# EAGLE design SparkFun_Qwiic_PIR (EAGLE 9.6.0)
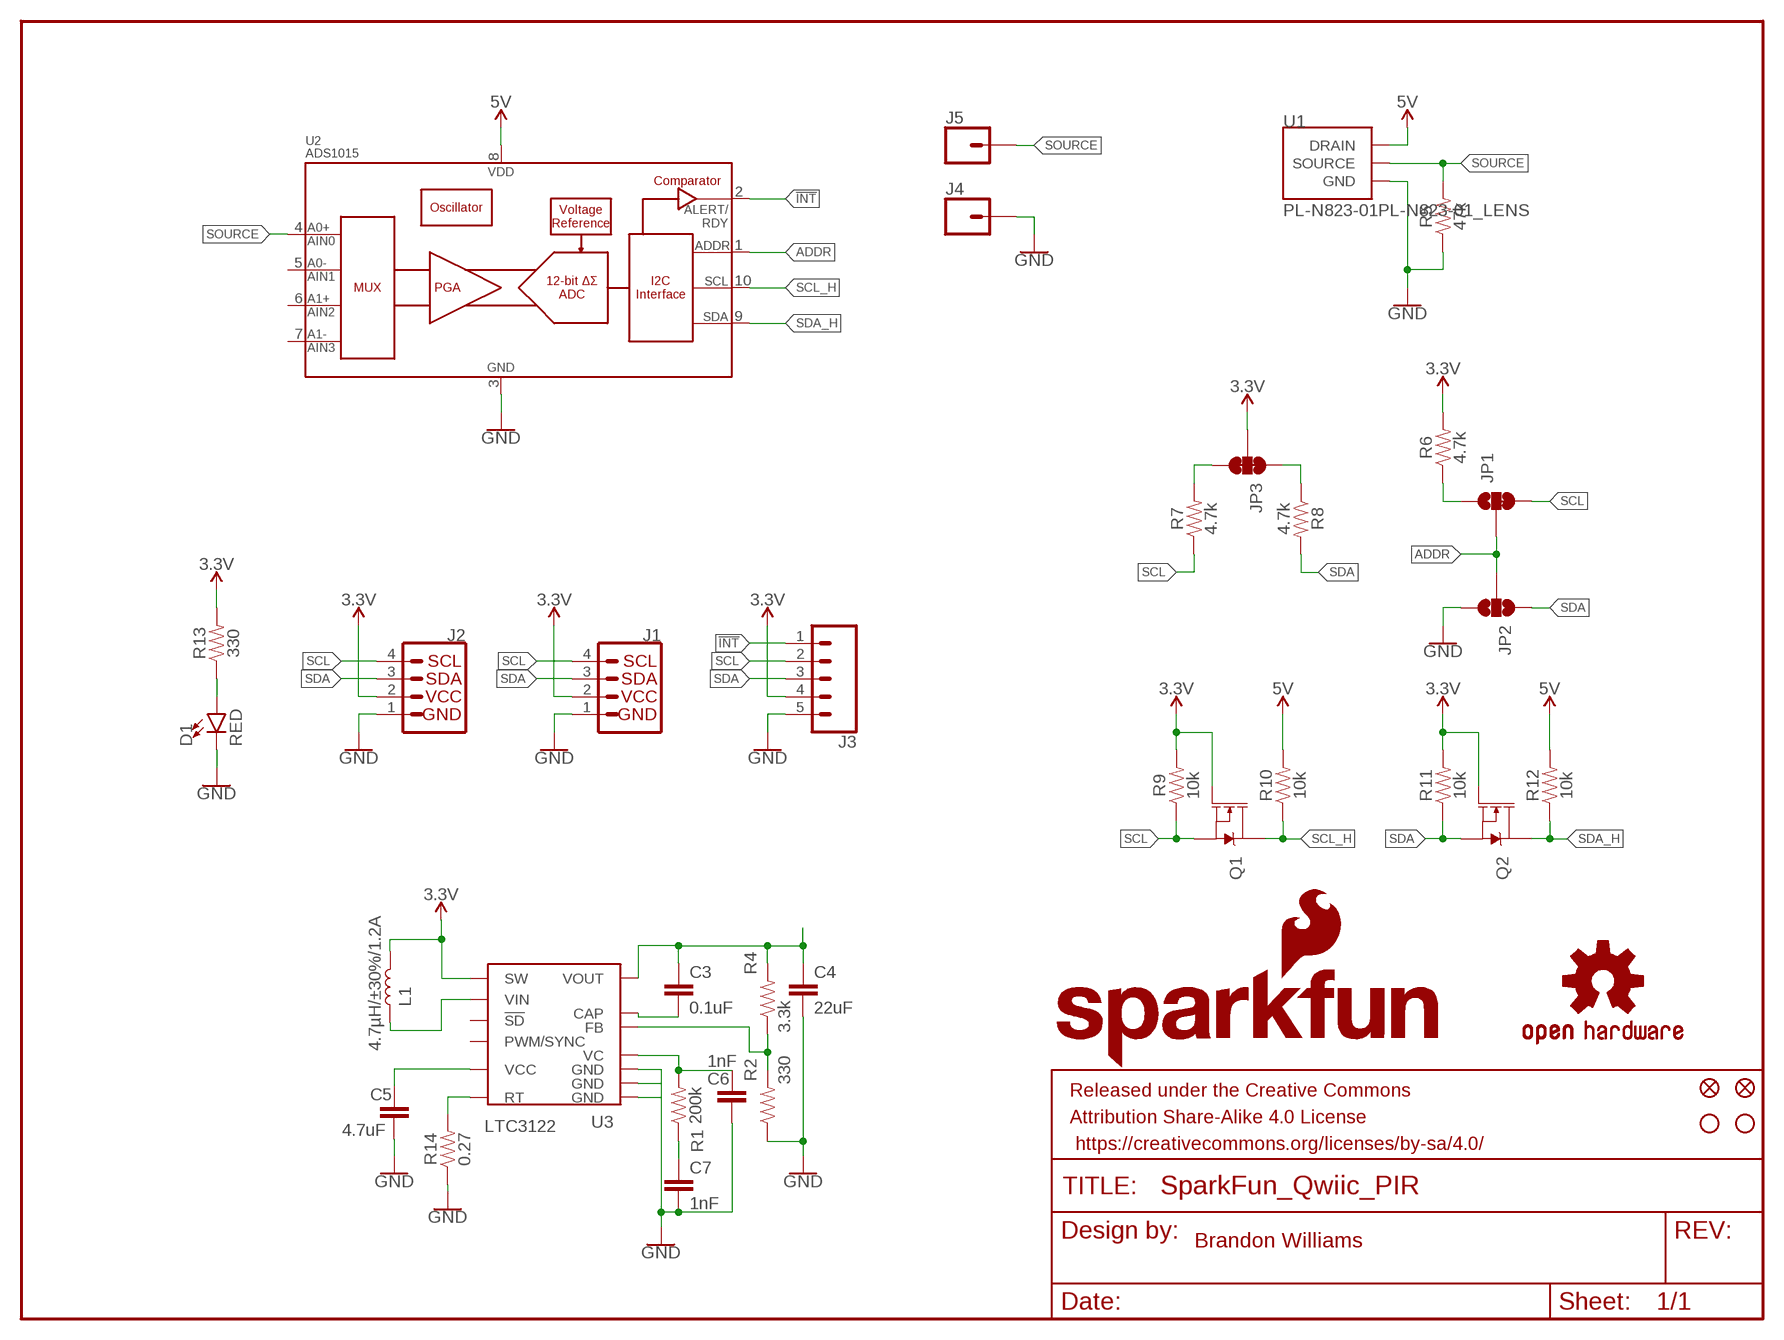
[diagram p0: schematic, sheet 1]

## Parts
C3  0.1uF  0.1UF-0603-25V-(+80/-20%)  [0603]
C4  22uF  22UF-0805-6.3V-20%  [0805]
C5  4.7uF  4.7UF-1206-16V-(+80/-20%)  [1206]
C6  1nF  1.0NF/1000PF-0603-50V-10%  [0603]
C7  1nF  1.0NF/1000PF-0603-50V-10%  [0603]
D1  RED  LED-RED0603  [LED-0603]
FD1  FIDUCIAL0.2MM  [FIDUCIAL-0.2MM]
FD2  FIDUCIAL0.2MM  [FIDUCIAL-0.2MM]
FRAME1  FRAME-LETTERNO_PACKAGE  [DUMMY]
H1  STAND-OFFTIGHT  [STAND-OFF-TIGHT]
H2  STAND-OFFTIGHT  [STAND-OFF-TIGHT]
J1  QWIIC_RIGHT_ANGLE  QWIIC_CONNECTORJS-1MM  [JST04_1MM_RA]
J2  QWIIC_RIGHT_ANGLE  QWIIC_CONNECTORJS-1MM  [JST04_1MM_RA]
J3  CONN_05NO_SILK  [1X05_NO_SILK]
J4  CONN_01PTH_NO_SILK_YES_STOP  [1X01_NO_SILK]
J5  CONN_01PTH_NO_SILK_YES_STOP  [1X01_NO_SILK]
JP1  JUMPER-SMT_3_1-NC_TRACE_SILK  [SMT-JUMPER_3_1-NC_TRACE_SILK]
JP2  JUMPER-SMT_3_NO_SILK  [SMT-JUMPER_3_NO_SILK]
JP3  JUMPER-SMT_3_2-NC_TRACE_SILK  [SMT-JUMPER_3_2-NC_TRACE_SILK]
L1  4.7µH/±30%/1.2A  INDUCTOR-CDRH-4.7UH  [INDUCTOR_4.7UH]
LOGO1  OSHW-LOGOMINI  [OSHW-LOGO-MINI]
LOGO3  SFE_LOGO_NAME_FLAME.2_INCH  [SFE_LOGO_NAME_FLAME_.2]
Q1  220mA/50V/3.5Ω  MOSFET-NCH-BSS138  [SOT23-3]
Q2  220mA/50V/3.5Ω  MOSFET-NCH-BSS138  [SOT23-3]
R1  200k  200KOHM-0603-1/10W-1%  [0603]
R2  330  330OHM-0603-1/10W-1%  [0603]
R4  3.3k  3.3KOHM-0603-1/10W-1%  [0603]
R5  47k  47KOHM-0603-1/10W-1%  [0603]
R6  4.7k  4.7KOHM-0603-1/10W-1%  [0603]
R7  4.7k  4.7KOHM-0603-1/10W-1%  [0603]
R8  4.7k  4.7KOHM-0603-1/10W-1%  [0603]
R9  10k  10KOHM-0402T-1/16W-1%  [0402-TIGHT]
R10  10k  10KOHM-0402T-1/16W-1%  [0402-TIGHT]
R11  10k  10KOHM-0402T-1/16W-1%  [0402-TIGHT]
R12  10k  10KOHM-0402T-1/16W-1%  [0402-TIGHT]
R13  330  330OHM-0603-1/10W-1%  [0603]
R14  0.27  0.27OHM-0603-1/10W-1%  [0603]
U1  PL-N823-01PL-N823-01_LENS  [PL-N823-01_LENS]
U2  ADS1015  [MSOP10]
U3  LTC3122  [LTC3122EDE#PBF]

## Nets
3.3V: J1.2 J2.2 J3.4 JP3.2 L1.P$2 Q1.1(G) Q2.1(G) R6.2 R9.2 R11.2 R13.2 U3.P$1(SW)
5V: R10.2 R12.2 U1.DRAIN U2.8(VDD)
!INT: J3.1 U2.2(ALERT/RDY)
ADDR: JP1.2 JP2.2 U2.1(ADDR)
GND: C4.2 C5.2 C6.2 C7.2 D1.C J1.1 J2.1 J3.5 J4.1 JP2.3 R2.1 R5.1 R14.1 U1.GND@1(GND) U1.GND@2(GND) U2.3(VSS) U3.P$2(GND) U3.P$10(GND) U3.P$13(GND)
N$1: C5.1 U3.P$5(VCC)
N$2: JP1.1 R6.1
N$3: L1.P$1 U3.P$3(VIN)
N$4: D1.A R13.1
N$5: R14.2 U3.P$6(RT)
N$6: C3.1 C4.1 R4.2 U3.P$11(VOUT)
N$7: C3.2 U3.P$12(CAP)
N$8: JP3.1 R8.1
N$9: JP3.3 R7.2
N$10: R2.2 R4.1 U3.P$8(FB)
N$11: C6.1 R1.2 U3.P$7(VC)
N$12: C7.1 R1.1
SCL: J1.4 J2.4 J3.2 JP1.3 Q1.2(S) R7.1 R9.1
SCL_H: Q1.3(D) R10.1 U2.10(SCL)
SDA: J1.3 J2.3 J3.3 JP2.1 Q2.2(S) R8.2 R11.1
SDA_H: Q2.3(D) R12.1 U2.9(SDA)
SOURCE: J5.1 R5.2 U1.SOURCE U2.4(AIN0)
Unconnected: U2.5(AIN1) U2.6(AIN2) U2.7(AIN3) U3.P$4(PWM/SYNC) U3.P$9(!SD)

## Notes on the sheet
- Brandon Williams

## Library data of the parts
C3 = SparkFun-Capacitors:0.1UF: 0.1µF ceramic capacitors A capacitor is a passive two-terminal electrical component used to store electrical energy temporarily in an electric field.; PROD_ID: CAP-00810
C4 = SparkFun-Capacitors:22UF: 22µF ceramic capacitors A capacitor is a passive two-terminal electrical component used to store electrical energy temporarily in an electric field.; PROD_ID: CAP-08402
C5 = SparkFun-Capacitors:4.7UF: 4.7µF ceramic capacitors A capacitor is a passive two-terminal electrical component used to store electrical energy temporarily in an electric field.; PROD_ID: CAP-10300
C6 C7 = SparkFun-Capacitors:1.0NF/1000PF: 1nF/1,000pF ceramic capacitors A capacitor is a passive two-terminal electrical component used to store electrical energy temporarily in an electric field.; PROD_ID: CAP-07886
D1 = SparkFun-LED:LED-RED: Red SMD LED Used in manufacturing of most products at SparkFun Packages: 0603 - SMD 0603 package [Product Link] <http://docs.avagotech.com/docs/AV02-0551EN> 0603 SMART - SMD 0603 SMART package ( more efficient and expensive)[Product Link] <http://www.osram-os.com/Graphics/XPic2/00077099_0.pdf> 1206 - SMD1206 package [Product Link] <https://www.sparkfun.com/datasheets/DevTools/LilyPad/Q150OVS4.pdff> SparkFun Products: Pro Mini 328 -5V <https://www.sparkfun.com/products/821> RedBoard <https://www.sparkfun.com/products/12757> IOIO-OTG <https://www.sparkfun.com/products/13613>; PROD_ID: DIO-00819
FD1 FD2 = SparkFun-Aesthetics:FIDUCIAL: Fiducial Alignment Points Point-of-reference for pick-and-place machines and other optical instruments.
FRAME1 = SparkFun-Aesthetics:FRAME-LETTER: Schematic Frame - Letter Standard 8.5x11 US Letter frame; DESIGNER: Nobody; VERSION: v01
H1 H2 = SparkFun-Hardware:STAND-OFF: Stand Off Drill holes for mechanically mounting via screws, standoffs, etc. Note: Use the keepout ring to avoid running the screw head into surrounding components. Variant Overviews STAND-OFF - Mechanical footprint for a #4 phillips button head screw. STAND-OFF-TIGHT - Mechanical footprint for a #4 phillips button head screw, Example SparkFun Products Screw - Phillips Head (1/4", 4-40, 10 pack) <https://www.sparkfun.com/products/10453> (PRT-10453) Screw - Phillips Head (1/2", 4-40, 10 pack) <https://www.sparkfun.com/products/10452> (PRT-10452) Screw - Phillips Head (3/4", 4-40, 10 pack) <https://www.sparkfun.com/products/10451> (PRT-10451) Screw - Phillips Head (1", 4-40, 10 pack) <https://www.sparkfun.com/products/10450> (PRT-10450)
J1 J2 = SparkFun-Connectors:QWIIC_CONNECTOR: SparkFun I2C Standard Qwiic Connector An SMD 1mm pitch JST connector makes it easy and quick (get it? Qwiic?) to connect I2C devices to each other. The Qwiic system <http://www.sparkfun.com/qwiic> enables fast and solderless connection between popular platforms and various sensors and actuators. We carry 200mm <https://www.sparkfun.com/products/14204>, 100mm <https://www.sparkfun.com/products/14205>, 50mm <https://www.sparkfun.com/products/14206>, and breadboard friendly <https://www.sparkfun.com/products/14207> Qwiic cables. We also offer 10 pcs strips <https://www.sparkfun.com/products/14323> the SMD connectors.; PROD_ID: CONN-13694
J3 = SparkFun-Connectors:CONN_05: Multi connection point. Often used as Generic Header-pin footprint for 0.1 inch spaced/style header connections On any of the 0.1 inch spaced packages, you can populate with these: Break Away Headers - Straight <https://www.sparkfun.com/products/116> (PRT-00116) Break Away Male Headers - Right Angle <https://www.sparkfun.com/products/553> (PRT-00553) Female Headers <https://www.sparkfun.com/products/115> (PRT-00115) Break Away Headers - Machine Pin <https://www.sparkfun.com/products/117> (PRT-00117) Break Away Female Headers - Swiss Machine Pin <https://www.sparkfun.com/products/743> (PRT-00743) For SCREWTERMINALS and SPRING TERMINALS visit here: Screw Terimnals on SparkFun.com <https://www.sparkfun.com/search/results?term=Screw+Terminals> (5mm/3.5mm/2.54mm spacing) This device is also useful as a general connection point to wire up your design to another part of your project. Our various solder wires solder well into these plated through hole pads. Hook-Up Wire - Assortment (Stranded, 22 AWG) <https://www.sparkfun.com/products/11375> (PRT-11375) Hook-Up Wire - Assortment (Solid Core, 22 AWG) <https://www.sparkfun.com/products/11367> (PRT-11367) View the entire wire category on our website here <https://www.sparkfun.com/categories/141> Special notes: Molex polarized connector foot print use with SKU : PRT-08231 with associated crimp pins and housings. 1MM SMD Version SKU: PRT-10208
J4 J5 = SparkFun-Connectors:CONN_01: Single connection point. Often used as Generic Header-pin footprint for 0.1 inch spaced/style header connections On any of the 0.1 inch spaced packages, you can populate with these: Break Away Headers - Straight <https://www.sparkfun.com/products/116> (PRT-00116) Break Away Male Headers - Right Angle <https://www.sparkfun.com/products/553> (PRT-00553) Female Headers <https://www.sparkfun.com/products/115> (PRT-00115) Break Away Headers - Machine Pin <https://www.sparkfun.com/products/117> (PRT-00117) Break Away Female Headers - Swiss Machine Pin <https://www.sparkfun.com/products/743> (PRT-00743) This device is also useful as a general connection point to wire up your design to another part of your project. Our various solder wires solder well into these plated through hole pads. Hook-Up Wire - Assortment (Stranded, 22 AWG) <https://www.sparkfun.com/products/11375> (PRT-11375) Hook-Up Wire - Assortment (Solid Core, 22 AWG) <https://www.sparkfun.com/products/11367> (PRT-11367) View the entire wire category on our website here <https://www.sparkfun.com/categories/141> Special notes: SMTSO-256-ET is a "flush mount" nut for a 4-40 screw. We mostly use this on specialty testbeds; it is a nice way to connect hardware to your PCB at an adjustable hieght. Also note, the SNAP packages are for using a snappable style connector. We sell a baggie of snaps and they are also used on two LilyPad designs: Snap Assortment - 30 pack (male and female) <https://www.sparkfun.com/products/11347> (DEV-11347) LilyPad Arduino SimpleSnap <https://www.sparkfun.com/products/10941> (DEV-10941) LilyPad SimpleSnap Protoboard <https://www.sparkfun.com/products/10940> (DEV-10940)
JP1 = SparkFun-Jumpers:JUMPER-SMT_3_1-NC_TRACE: Normally closed trace jumper (1 of 2 connections) This jumper has a trace between two pads so it's normally closed (NC). The other connection is normally open (NO). Use a razor knife to open the connection. For best results follow the IPC guidelines for cutting traces: Cutout at least 0.063 mm (0.005 in). Remove all loose material to clean up the cut area. Seal the cut with an approved epoxy. Reapply solder to reclose the connection, or to close the NO connection.
JP2 = SparkFun-Jumpers:JUMPER-SMT_3_NO: Normally open jumper This jumper has three pads in close proximity to each other. Apply solder to close the connection(s).
JP3 = SparkFun-Jumpers:JUMPER-SMT_3_2-NC_TRACE: Normally closed trace jumper (2 of 2 connections) This jumper has a trace between all three pads so they are normally closed (NC). Use a razor knife to open the connection(s). For best results follow the IPC guidelines for cutting traces: Cutout at least 0.063 mm (0.005 in). Remove all loose material to clean up the cut area. Seal the cut with an approved epoxy. Reapply solder to reclose the connection(s).
L1 = SparkFun-Coils:INDUCTOR: Inductors Resist changes in electrical current. Basically a coil of wire. SparkFun Products: SparkFun Load Cell Amplifier - HX711 <https://www.sparkfun.com/products/13879> IOIO-OTG - V2.2 <https://www.sparkfun.com/products/13613>; PROD_ID: NDUC-10146
LOGO1 = SparkFun-Aesthetics:OSHW-LOGO: Open-Source Hardware (OSHW) Logo This logo indicates the piece of hardware it is found on incorporates a OSHW license and/or adheres to the definition of open source hardware found here: http://freedomdefined.org/OSHW
LOGO3 = SparkFun-Aesthetics:SFE_LOGO_NAME_FLAME: SparkFun Font Logo w/ Flame This is the SparkFun full logo. The logo on the schematic will always be the same size; the package variant is the height of the flame part of the logo. Default layer for the logo on the board is tSilk.
Q1 Q2 = SparkFun-DiscreteSemi:MOSFET-NCH: N-channel MOSFETs Voltage controlled devices that allow control of high current outputs. SparkFun Products: SparkFun OpenScale <https://www.sparkfun.com/products/13261> SparkFun Digital Sandbox <https://www.sparkfun.com/products/12651> SparkFun Monster Moto Shield <https://www.sparkfun.com/products/10182> SparkFun MOSFET Power Controller <https://www.sparkfun.com/products/11214>; PROD_ID: TRANS-00830
R1 = SparkFun-Resistors:200KOHM: 200kΩ resistor A resistor is a passive two-terminal electrical component that implements electrical resistance as a circuit element. Resistors act to reduce current flow, and, at the same time, act to lower voltage levels within circuits. - Wikipedia; PROD_ID: RES-09385
R2 R13 = SparkFun-Resistors:330OHM: 330Ω resistor A resistor is a passive two-terminal electrical component that implements electrical resistance as a circuit element. Resistors act to reduce current flow, and, at the same time, act to lower voltage levels within circuits. - Wikipedia; PROD_ID: RES-00818
R4 = SparkFun-Resistors:3.3KOHM: 3.3kΩ resistor A resistor is a passive two-terminal electrical component that implements electrical resistance as a circuit element. Resistors act to reduce current flow, and, at the same time, act to lower voltage levels within circuits. - Wikipedia; PROD_ID: RES-07851
R5 = SparkFun-Resistors:47KOHM: 47kΩ resistor A resistor is a passive two-terminal electrical component that implements electrical resistance as a circuit element. Resistors act to reduce current flow, and, at the same time, act to lower voltage levels within circuits. - Wikipedia; PROD_ID: RES-07871
R6-R8 = SparkFun-Resistors:4.7KOHM: 4.7kΩ resistor A resistor is a passive two-terminal electrical component that implements electrical resistance as a circuit element. Resistors act to reduce current flow, and, at the same time, act to lower voltage levels within circuits. - Wikipedia; PROD_ID: RES-07857
R9-R12 = SparkFun-Resistors:10KOHM: 10kΩ resistor A resistor is a passive two-terminal electrical component that implements electrical resistance as a circuit element. Resistors act to reduce current flow, and, at the same time, act to lower voltage levels within circuits. - Wikipedia; PROD_ID: RES-14241
R14 = SparkFun-Resistors:0.27OHM: 0.27Ω resistor A resistor is a passive two-terminal electrical component that implements electrical resistance as a circuit element. Resistors act to reduce current flow, and, at the same time, act to lower voltage levels within circuits. - Wikipedia; PROD_ID: RES-08787
U1 = PL-N823-01:PL-N823-01: Lensless passive infrared sensor from Kemet Electronics
U2 = SparkFun-IC-Conversion:ADS1015: ADS1015 12-BIT ADC 12-Bit Del-Sig ADC Four single-ended inputs or two differential inputs Internal PGA I2C interface 2.0-5.5V SparkFun Products SparkFun Block for Intel Edison - ADC <https://www.sparkfun.com/products/13770> (DEV-13770); PROD_ID: IC-12270
U3 = LTC3122:LTC3122; PROD_ID: LTC3122

## Board
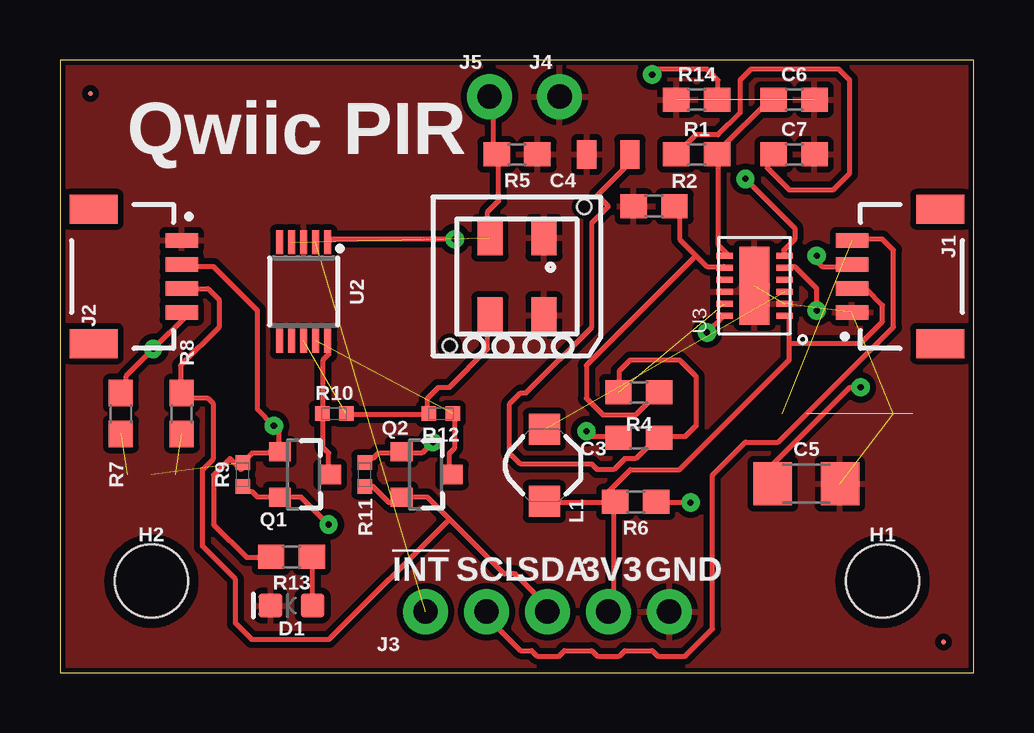
[diagram p1: board, top side]
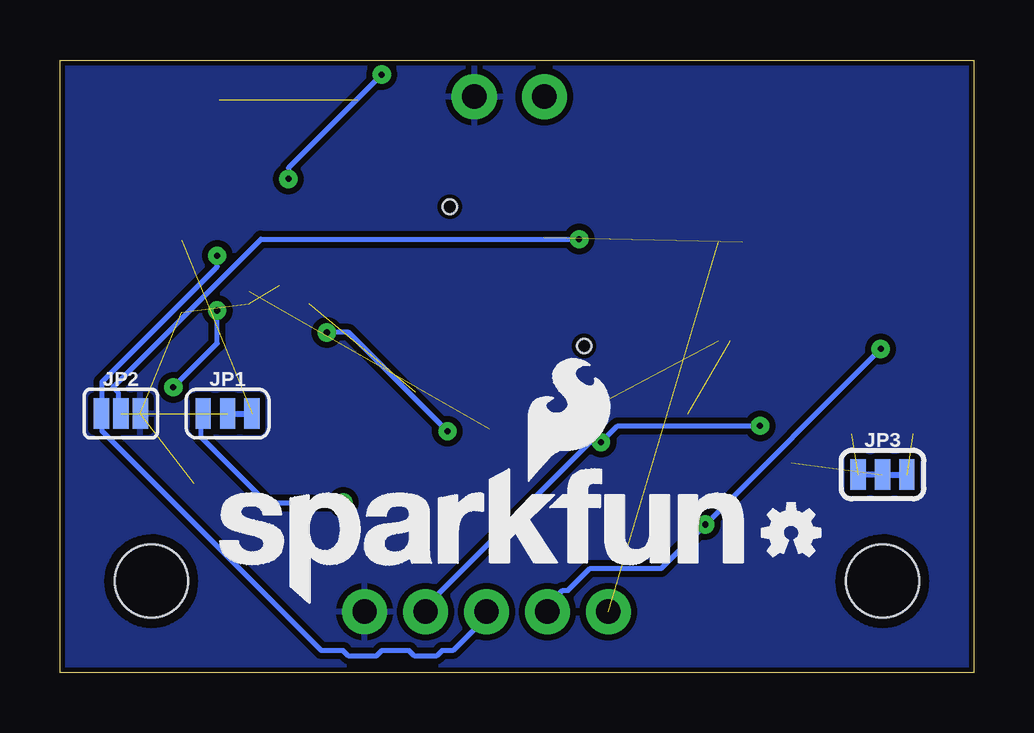
[diagram p2: board, bottom side, seen from below]

Size 38.1 x 25.53 mm. Coordinates in mm from the lower left corner, seen from the top.
Outline: 0,0 38.1,0 38.1,25.53 0,25.53 0,0
Copper layers (1*16): Top 0.035mm / dielectric 1.5mm / Bottom 0.035mm
Design rules "SparkFun-2-layer-STANDARD *": minimum track width 8mil, minimum drill 10mil, track to track 10mil, track to pad 8mil, pad to pad 8mil, via to via 10mil, smd to smd 8mil, copper to edge 8mil, drill to drill 8mil, minimum pad ring 10mil, minimum via ring 10mil, stop-mask expansion 4mil, vias tented up to drill 25mil, thermal gap 10mil

### Footprints (pad centres in the part's own frame; a part is rotated, then mirrored left to right if it is on the bottom)
0603 = smd 1.1 x 1: 1 -0.85,0; 2 0.85,0
0805 = smd 0.8 x 1.2: 1 -0.9,0; 2 0.9,0
1206 = smd 1.6 x 1.8: 1 -1.4,0; 2 1.4,0
LED-0603 = smd 1 x 1: A -0.877,0; C 0.877,0
FIDUCIAL-0.2MM = smd 0.2 x 0.2: 1 0,0
STAND-OFF-TIGHT = hole 3.048: 0,0
JST04_1MM_RA = smd 0.6 x 1.35: 1 -1.5,0; 2 -0.5,0; 3 0.5,0; 4 1.5,0 | smd 1.2 x 2: NC1 2.8,-3.675; NC2 -2.8,-3.675
1X05_NO_SILK = drill 1.016 pad 1.88: 1 0,0; 2 2.54,0; 3 5.08,0; 4 7.62,0; 5 10.16,0
1X01_NO_SILK = drill 1.016 pad 1.88: 1 0,0
SMT-JUMPER_3_1-NC_TRACE_SILK = smd 0.635 x 1.27: 1 -1.016,0; 2 0,0; 3 1.016,0
SMT-JUMPER_3_NO_SILK = smd 0.635 x 1.27: 1 -0.813,0; 2 0,0; 3 0.813,0
SMT-JUMPER_3_2-NC_TRACE_SILK = smd 0.635 x 1.27: 1 -1.016,0; 2 0,0; 3 1.016,0
INDUCTOR_4.7UH = smd 1.3 x 1.3: P$1 -1.5,0; P$2 1.5,0
SOT23-3 = smd 0.8 x 0.9: 1 -0.95,-1; 2 0.95,-1; 3 0,1.1
0402-TIGHT = smd 0.6 x 0.6: 1 -0.5,0; 2 0.5,0
PL-N823-01_LENS = smd 1.05 x 1.475: DRAIN -1.125,-1.613; GND@1 1.125,1.613; GND@2 1.125,-1.613; SOURCE -1.125,1.613 | hole 0.6: -2.8,-2.9; 2.8,2.9
MSOP10 = smd 0.3 x 1: 1 -1,-2.05; 2 -0.5,-2.05; 3 0,-2.05; 4 0.5,-2.05; 5 1,-2.05; 6 1,2.05; 7 0.5,2.05; 8 0,2.05; 9 -0.5,2.05; 10 -1,2.05
LTC3122EDE#PBF = smd 0.25 x 0.7: P$1 -1.25,-1.25; P$2 -0.75,-1.25; P$3 -0.25,-1.25; P$4 0.25,-1.25; P$5 0.75,-1.25; P$6 1.25,-1.25; P$7 1.25,1.25; P$8 0.75,1.25; P$9 0.25,1.25; P$10 -0.25,1.25; P$11 -0.75,1.25; P$12 -1.25,1.25 | smd 3.25 x 1.25: P$13 0,0

### Placement (x,y rotation side)
C3  24.13,9.78 180 top
C4  22.86,21.59 180 top
C5  31.11,7.87 0 top
C6  30.61,23.88 0 top
C7  30.61,21.59 0 top
D1  9.65,2.79 180 top
FD1  36.83,1.27 0 top
FD2  1.27,24.13 0 top
FRAME1  0,0 0 top
H1  34.29,3.81 0 top
H2  3.81,3.81 0 top
J1  33.02,16.51 90 top
J2  5.08,16.51 270 top
J3  15.24,2.54 0 top
J4  20.83,24 0 top
J5  17.91,24 0 top
JP1  31.11,10.79 0 bottom
JP2  35.56,10.79 0 bottom
JP3  3.81,8.26 0 bottom
L1  20.19,8.64 270 top
LOGO1  7.62,5.84 0 bottom
LOGO3  20.45,5.71 0 bottom
Q1  10.16,8.26 270 top
Q2  15.24,8.26 270 top
R1  26.54,21.59 0 top
R2  24.77,19.43 0 top
R4  24.13,11.68 180 top
R5  19.05,21.59 180 top
R6  24,7.11 180 top
R7  2.54,10.79 270 top
R8  5.08,10.79 90 top
R9  7.62,8.26 90 top
R10  11.43,10.79 0 top
R11  12.7,8.26 90 top
R12  15.88,10.79 180 top
R13  9.65,4.83 180 top
R14  26.54,23.88 0 top
U1  19.05,16.51 0 top
U2  10.16,15.88 180 top
U3  28.96,16.13 90 top

### Tracks (layer width: path | path; a pad name or v marks a point on that pad's centre or on a via)
3.3V  (via drill 0.25)  (1 unrouted)
  Top 0.203: 30.4,13.72 30.4,13.03 25.83,8.46 23.77,8.46 22.86,7.54 22.86,7.32 23.09,7.09 | 30.4,13.72 30.4,14.86 U3.P$1 | 23.09,7.09 20.34,7.09 L1.P$2 | 30.4,13.72 33.38,13.72 34.29,14.63 34.29,15.32 33.6,16 33.15,16 J1.2 | 8.69,9.14 9.14,9.14 Q1.1 | 8.69,9.14 8,9.14 7.77,8.91 R9.2 7.77,8.69 7.54,8.46 7.09,8.91 6.4,8.23 6.4,6.17 7.77,4.8 8.69,4.8 R13.2 | 8.69,9.14 9.14,9.6 9.14,10.06 v8.91,10.29 8.23,10.97 8.23,15.09 6.4,16.92 5.26,16.92 J2.2 | R11.2 12.8,8.91 13.03,8.91 13.26,9.14 14.17,9.14 Q2.1 14.4,9.14 15.09,9.14 v15.54,9.6 | 23.09,7.09 23.09,2.97 22.86,2.74 J3.4 | 23.09,7.09 R6.2
  Bottom 0.203: J3.4 22.86,2.74 16,9.6 v15.54,9.6 14.86,10.29 v8.91,10.29
5V  (1 unrouted)
  Top 0.203: R10.2 12.12,10.74 15.32,10.74 R12.2 15.32,10.97 15.32,11.43 15.77,11.89 16.23,11.89 17.83,13.49 17.83,14.86 U1.DRAIN
!INT  (1 unrouted)
ADDR  (via drill 0.25)  (1 unrouted)
  Top 0.203: v16.46,18.06 11.2,18.06 U2.1
  Bottom 0.203: v16.46,18.06 29.72,18.06 35.89,11.89 35.66,11.66 35.66,10.97 JP2.2
GND  (5 unrouted)
  pour Top: 0,25.53 0,0 38.1,0 38.1,25.53
  pour Bottom: 0,25.53 0,0 38.1,0 38.1,25.53
N$1  (via drill 0.25)
  Top 0.203: v31.55,15.09 31.55,16 30.63,16.92 30.4,16.92 U3.P$5 | v33.38,11.89 32.92,11.89 29.72,8.69 29.72,8 C5.1
  Bottom 0.203: v31.55,15.09 31.55,13.72 v33.38,11.89
N$2  (via drill 0.25)
  Top 0.203: v26.29,7.09 24.92,7.09 R6.1
  Bottom 0.203: v26.29,7.09 29.49,7.09 32.23,9.83 32.23,10.74 JP1.1
N$3  (1 unrouted)
N$4
  Top 0.203: D1.A 10.52,2.97 10.52,4.8 R13.1
N$5  (via drill 0.25)
  Top 0.203: v28.57,20.57 30.63,18.52 30.63,18.06 30.18,17.6 30.18,17.37 U3.P$6 | v24.69,24.92 24.92,25.15 26.98,25.15 27.43,24.69 27.43,24 R14.2
  Bottom 0.203: v28.57,20.57 28.57,21.03 v24.69,24.92
N$6  (1 unrouted)
  Top 0.203: R4.2 23.32,11.89 23.32,12.57 23.77,13.03 25.83,13.03 26.52,12.34 26.52,10.29 26.06,9.83 25.15,9.83 C3.1 24.92,9.83 24,8.91 23.55,8.91 23.09,8.46 22.4,8.46 22.17,8.69 19.2,8.69 18.75,9.14 18.75,11.2 19.2,11.66 19.43,11.66 22.17,14.4 22.17,18.75 22.86,19.43 22.4,19.89 23.55,21.03 23.55,21.49 C4.1
N$7  (via drill 0.25)
  Top 0.203: v26.98,14.17 27.66,14.86 U3.P$12 | v21.95,10.06 22.17,9.83 23.09,9.83 C3.2
  Bottom 0.203: v26.98,14.17 26.06,14.17 v21.95,10.06
N$8  (1 unrouted)
N$9  (1 unrouted)
N$10
  Top 0.203: 26.52,17.37 25.83,18.06 25.83,19.43 R2.2 | 26.52,17.37 26.98,16.92 27.66,16.92 U3.P$8 | 26.52,17.37 21.95,12.8 21.95,11.43 22.63,10.74 24,10.74 24.92,11.66 R4.1
N$11
  Top 0.203: 27.43,21.49 27.43,17.83 27.89,17.37 U3.P$7 | 27.43,21.49 27.66,21.72 27.66,21.95 29.49,23.77 29.72,23.77 C6.1 | 27.43,21.49 R1.2
N$12
  Top 0.203: R1.1 25.83,21.72 26.52,22.4 27.43,22.4 28.35,23.32 28.35,24.69 28.8,25.15 32.46,25.15 32.92,24.69 32.92,20.8 32.23,20.12 30.4,20.12 29.49,21.03 29.49,21.26 29.72,21.49 C7.1
SCL  (via drill 0.25)  (1 unrouted)
  Top 0.203: R7.1 2.74,11.66 2.74,12.34 v3.89,13.49 5.26,14.86 J2.4 | R9.1 7.77,7.54 8,7.54 8.23,7.32 9.14,7.32 Q1.2 9.37,7.32 10.06,7.32 v11.2,6.17 | J1.4 33.15,18.06 34.29,18.06 34.75,17.6 34.75,14.4 29.95,9.6 28.57,9.6 27.2,8.23 27.2,1.83 26.06,0.69 24.92,0.69 24.69,0.91 23.55,0.91 23.32,0.69 22.4,0.69 22.17,0.91 21.03,0.91 20.8,0.69 19.89,0.69 19.66,0.91 19.2,0.91 17.6,2.52 J3.2
  Bottom 0.203: J3.2 17.83,2.74 17.14,3.43 16.92,3.43 16,4.34 13.03,4.34 v11.2,6.17 v3.89,13.49
SCL_H
  Top 0.203: Q1.3 11.2,8.46 11.2,9.14 10.97,9.37 10.97,10.74 R10.1 10.97,10.97 10.97,13.03 11.2,13.26 11.2,13.72 U2.10
SDA  (via drill 0.25)
  Top 0.203: J2.3 5.26,16 6.17,16 6.63,15.54 6.63,14.4 5.03,12.8 5.03,11.66 R8.2 5.26,11.43 6.17,11.43 6.4,11.2 6.4,8.91 5.94,8.46 5.94,5.26 7.32,3.89 7.32,2.06 8,1.37 11.2,1.37 16.23,6.4 | R11.1 12.8,7.77 13.03,7.77 13.72,7.09 14.17,7.09 Q2.2 14.4,7.32 15.32,7.32 16.23,6.4 | v31.55,17.37 31.55,17.14 31.77,16.92 32.92,16.92 J1.3 | 16.23,6.4 18.52,4.12 18.97,4.12 20.34,2.74 J3.3
  Bottom 0.203: J3.3 20.12,2.52 21.72,0.91 22.17,0.91 22.4,0.69 23.32,0.69 23.55,0.91 24.69,0.91 24.92,0.69 26.06,0.69 26.29,0.91 27.2,0.91 36.35,10.06 36.35,10.74 JP2.1 36.35,10.97 36.35,12.12 31.55,16.92 v31.55,17.37
SDA_H  (1 unrouted)
  Top 0.203: R12.1 16.46,10.74 16.46,9.37 16.23,9.14 16.23,8.46 Q2.3
SOURCE  (1 unrouted)
  Top 0.203: U1.SOURCE 17.83,18.29 17.83,19.2 18.29,19.66 18.29,21.49 R5.2 18.06,21.72 18.06,24 J5.1

### Text on the board
tPlace: Qwiic PIR | !INT | SCL | SDA | 3V3 | GND